# EAGLE design audio_controller_x2 (EAGLE 9.5.2)
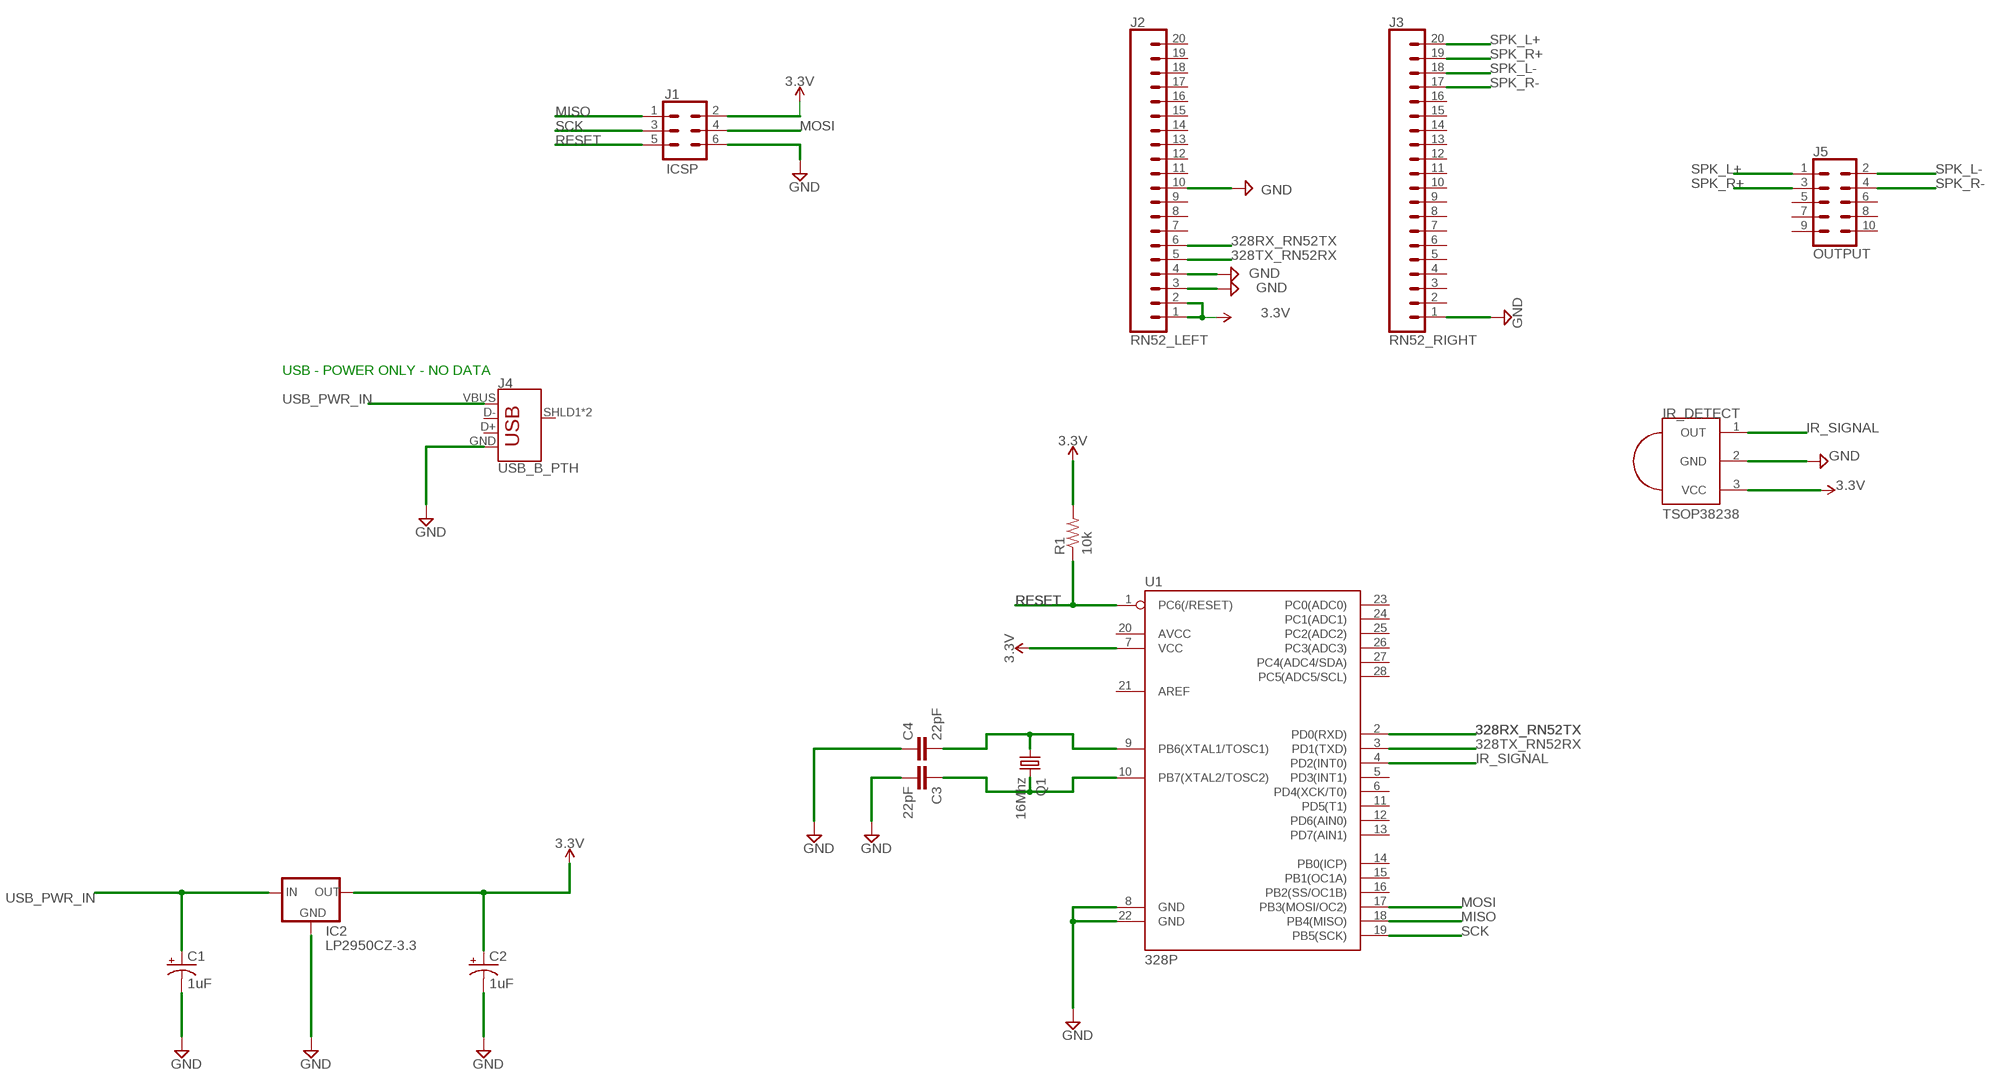
[diagram p0: schematic, sheet 1]

## Parts
C1  1uF  CPOL-USE2.5-5  [E2,5-5]
C2  1uF  CPOL-USE2.5-5  [E2,5-5]
C3  22pF  22PF-PTH-2.54MM-200V-5%  [CAP-PTH-2.54]
C4  22pF  22PF-PTH-2.54MM-200V-5%  [CAP-PTH-2.54]
IC2  LP2950CZ-3.3  [TO92]
IR_DETECT  TSOP38238  PNA460XM  [PNA460XM]
J1  ICSP  CONN_03X2SHROUD  [2X3-SHROUDED]
J2  RN52_LEFT  CONN_20  [1X20]
J3  RN52_RIGHT  CONN_20  [1X20]
J4  USB_B_PTH  [USB-B-PTH]
J5  OUTPUT  CONN_05X2SHD  [2X5-SHROUDED]
Q1  16Mhz  CRYSTALHC49S  [HC49/S]
R1  10k  R-US_0207/10  [0207/10]
U1  328P  ATMEGA328P_PDIP  [DIP28]

## Nets
3.3V: C2.+ IC2.1(OUT) IR_DETECT.3(VCC) J1.2 J2.1 J2.2 R1.2 U1.7(VCC)
328RX_RN52TX: J2.6 U1.2(PD0(RXD))
328TX_RN52RX: J2.5 U1.3(PD1(TXD))
GND: C1.- C2.- C3.2 C4.1 IC2.2(GND) IR_DETECT.2(GND) J1.6 J2.3 J2.4 J2.10 J3.1 J4.GND U1.8(GND) U1.22(GND)
IR_SIGNAL: IR_DETECT.1(OUT) U1.4(PD2(INT0))
MISO: J1.1 U1.18(PB4(MISO))
MOSI: J1.4 U1.17(PB3(MOSI/OC2))
N$2: C4.2 Q1.1 U1.9(PB6(XTAL1/TOSC1))
N$3: C3.1 Q1.2 U1.10(PB7(XTAL2/TOSC2))
RESET: J1.5 R1.1 U1.1(PC6(/RESET))
SCK: J1.3 U1.19(PB5(SCK))
SPK_L+: J3.20 J5.1
SPK_L-: J3.18 J5.2
SPK_R+: J3.19 J5.3
SPK_R-: J3.17 J5.4
USB_PWR_IN: C1.+ IC2.3(IN) J4.VBUS
Unconnected: J2.7 J2.8 J2.9 J2.11 J2.12 J2.13 J2.14 J2.15 J2.16 J2.17 J2.18 J2.19 J2.20 J3.2 J3.3 J3.4 J3.5 J3.6 J3.7 J3.8 J3.9 J3.10 J3.11 J3.12 J3.13 J3.14 J3.15 J3.16 J4.D+ J4.D- J4.SHLD1(SHIELD) J4.SHLD2(SHIELD) J5.5 J5.6 J5.7 J5.8 J5.9 J5.10 U1.5(PD3(INT1)) U1.6(PD4(XCK/T0)) U1.11(PD5(T1)) U1.12(PD6(AIN0)) U1.13(PD7(AIN1)) U1.14(PB0(ICP)) U1.15(PB1(OC1A)) U1.16(PB2(SS/OC1B)) U1.20(AVCC) U1.21(AREF) U1.23(PC0(ADC0)) U1.24(PC1(ADC1)) U1.25(PC2(ADC2)) U1.26(PC3(ADC3)) U1.27(PC4(ADC4/SDA)) U1.28(PC5(ADC5/SCL))

## Notes on the sheet
- USB - POWER ONLY - NO DATA

## Library data of the parts
C1 C2 = adafruit:CPOL-US: POLARIZED CAPACITOR, American symbol
C3 C4 = SparkFun-Capacitors:22PF: 22pF ceramic capacitors A capacitor is a passive two-terminal electrical component used to store electrical energy temporarily in an electric field.; PROD_ID: CAP-09128
IC2 = v-reg:LP2950?*: Source: http://cache.national.com/ds/LP/LP2950.pdf
IR_DETECT = adafruit:PNA460XM: IR 38KHz receiver PNA4602 and related receivers http://www.ladyada.net/library/pcb/eaglelibrary.html; SPICEPREFIX: J
J1 = SparkFun-Connectors:CONN_03X2: Multi connection point. Often used as Generic Header-pin footprint for 0.1 inch spaced/style header connections You can populate with any combo of single row headers, but if you'd like an exact match, check these: Header - 2x3 (Male, 0.1") <https://www.sparkfun.com/products/12807> (PRT-12807) Header - 2x3 (Female, 0.1") <https://www.sparkfun.com/products/13010> (PRT-13010) 2x3 Pin Shrouded Header <https://www.sparkfun.com/products/10877> (PRT-10877) On any of the 0.1 inch spaced packages, you can populate with these: Break Away Headers - Straight <https://www.sparkfun.com/products/116> (PRT-00116) Break Away Male Headers - Right Angle <https://www.sparkfun.com/products/553> (PRT-00553) Female Headers <https://www.sparkfun.com/products/115> (PRT-00115) Break Away Headers - Machine Pin <https://www.sparkfun.com/products/117> (PRT-00117) Break Away Female Headers - Swiss Machine Pin <https://www.sparkfun.com/products/743> (PRT-00743) Special note: the shrouded connector mates well with our 3x2 ribbon cables: Ribbon Crimp Connector - 6-pin (2x3, Female) <https://www.sparkfun.com/products/10651> (PRT-10651) Ribbon Cable - 6 wire (15ft) <https://www.sparkfun.com/products/10646> (PRT-10646); PROD_ID: CONN-10681; SF_ID: PRT_10877
J2 J3 = SparkFun-Connectors:CONN_20: Multi connection point. Often used as Generic Header-pin footprint for 0.1 inch spaced/style header connections On any of the 0.1 inch spaced packages, you can populate with these: Break Away Headers - Straight <https://www.sparkfun.com/products/116> (PRT-00116) Break Away Male Headers - Right Angle <https://www.sparkfun.com/products/553> (PRT-00553) Female Headers <https://www.sparkfun.com/products/115> (PRT-00115) Break Away Headers - Machine Pin <https://www.sparkfun.com/products/117> (PRT-00117) Break Away Female Headers - Swiss Machine Pin <https://www.sparkfun.com/products/743> (PRT-00743) For SCREWTERMINALS and SPRING TERMINALS visit here: Screw Terimnals on SparkFun.com <https://www.sparkfun.com/search/results?term=Screw+Terminals> (5mm/3.5mm/2.54mm spacing) This device is also useful as a general connection point to wire up your design to another part of your project. Our various solder wires solder well into these plated through hole pads. Hook-Up Wire - Assortment (Stranded, 22 AWG) <https://www.sparkfun.com/products/11375> (PRT-11375) Hook-Up Wire - Assortment (Solid Core, 22 AWG) <https://www.sparkfun.com/products/11367> (PRT-11367) View the entire wire category on our website here <https://www.sparkfun.com/categories/141> Special notes: Molex polarized connector foot print use with SKU : PRT-08231 with associated crimp pins and housings. 1MM SMD Version SKU: PRT-10208 NOTES ON THE VARIANTS LOCK and LOCK_LONGPADS... This footprint was designed to help hold the alignment of a through-hole component (i.e. 6-pin header) while soldering it into place. You may notice that each hole has been shifted either up or down by 0.005 of an inch from it's more standard position (which is a perfectly straight line). This slight alteration caused the pins (the squares in the middle) to touch the edges of the holes. Because they are alternating, it causes a "brace" to hold the component in place. 0.005 has proven to be the perfect amount of "off-center" position when using our standard breakaway headers. Although looks a little odd when you look at the bare footprint, once you have a header in there, the alteration is very hard to notice. Also,if you push a header all the way into place, it is covered up entirely on the bottom side. Note about LOCK SPECIAL package: This is just like the LOCK variant in that the holes are staggared by 5 mil, but except for the last two holes. They are not altered from the "standard" footprint layout. This is used for a special purpose on the layout of our Graphic LCD Backpack. Make sure you want to use this device before selecting it for you project!
J4 = SparkFun-Connectors:USB_B: USB Type B Connector SparkFun Products: SparkFun Stepoko <https://www.sparkfun.com/products/13899> PTH; PROD_ID: CONN-08278; SF_ID: PRT-00139
J5 = SparkFun-Connectors:CONN_05X2: Multi connection point. Often used as Generic Header-pin footprint for 0.1 inch spaced/style header connections For AVR SPI programming port, see special device with nice symbol: "AVR_SPI_PROG_5x2.dev" You can populate with any combo of single row headers, but if you'd like an exact match, check these: 2x5 AVR ICSP Male Header <https://www.sparkfun.com/products/778> (PRT-00778) 2x5 Pin Shrouded Header <https://www.sparkfun.com/products/8506> (PRT-08506) On any of the 0.1 inch spaced packages, you can populate with these: Break Away Headers - Straight <https://www.sparkfun.com/products/116> (PRT-00116) Break Away Male Headers - Right Angle <https://www.sparkfun.com/products/553> (PRT-00553) Female Headers <https://www.sparkfun.com/products/115> (PRT-00115) Break Away Headers - Machine Pin <https://www.sparkfun.com/products/117> (PRT-00117) Break Away Female Headers - Swiss Machine Pin <https://www.sparkfun.com/products/743> (PRT-00743) Special note: the shrouded connector mates well with our 5x2 ribbon cables: 2x5 Pin IDC Ribbon Cable <https://www.sparkfun.com/products/8535> (PRT-08535); PROD_ID: CONN-08671; SF_ID: PRT-08506
Q1 = crystal:CRYSTAL: CRYSTAL; OC_FARNELL: 1667008; OC_NEWARK: unknown
R1 = adafruit:R-US_: RESISTOR, American symbol
U1 = SparkFun-IC-Microcontroller:ATMEGA328P_PDIP: Atmel 328P Through hole ATMEGA328P uC used in the Arduino 32kb flash, 1k EEPROM, 2k SRAM Datasheet <http://www.sparkfun.com/datasheets/Components/SMD/ATMega328.pdf> SparkFun Products Storefront component: AVR 28 Pin 20MHz 32K 6A/D - ATMega328P <https://www.sparkfun.com/products/9061> (COM-09061) SparkFun Simon Says - Through-Hole Soldering Kit <https://www.sparkfun.com/products/10547> (KIT-10547) SparkFun Learn to Solder - Simon Says <https://www.sparkfun.com/products/13708> (KIT-13708) SparkFun BigTime Watch Kit <https://www.sparkfun.com/products/11734> (KIT-11734) SparkFun ClockIt <https://www.sparkfun.com/products/10930> (KIT-10930) SparkFun Serial Enabled LCD Kit <https://www.sparkfun.com/products/10097> (LCD-10097) SparkFun Simon Tilts - Through Hole Soldering Kit <https://www.sparkfun.com/products/12634> (KIT-12634) SparkFun Frequency Counter Kit <https://www.sparkfun.com/products/10140> (KIT-10140) FabFM Radio Kit <https://www.sparkfun.com/products/11043> (KIT-11043) SparkFun Binary Blaster Kit <https://www.sparkfun.com/products/12037> (KIT-12037) SparkFun Metro-Gnome <https://www.sparkfun.com/products/9236> (KIT-09236) ATmega328 with Arduino Optiboot (Uno) <https://www.sparkfun.com/products/10524> (DEV-10524); PROD_ID: IC-09136

## Board
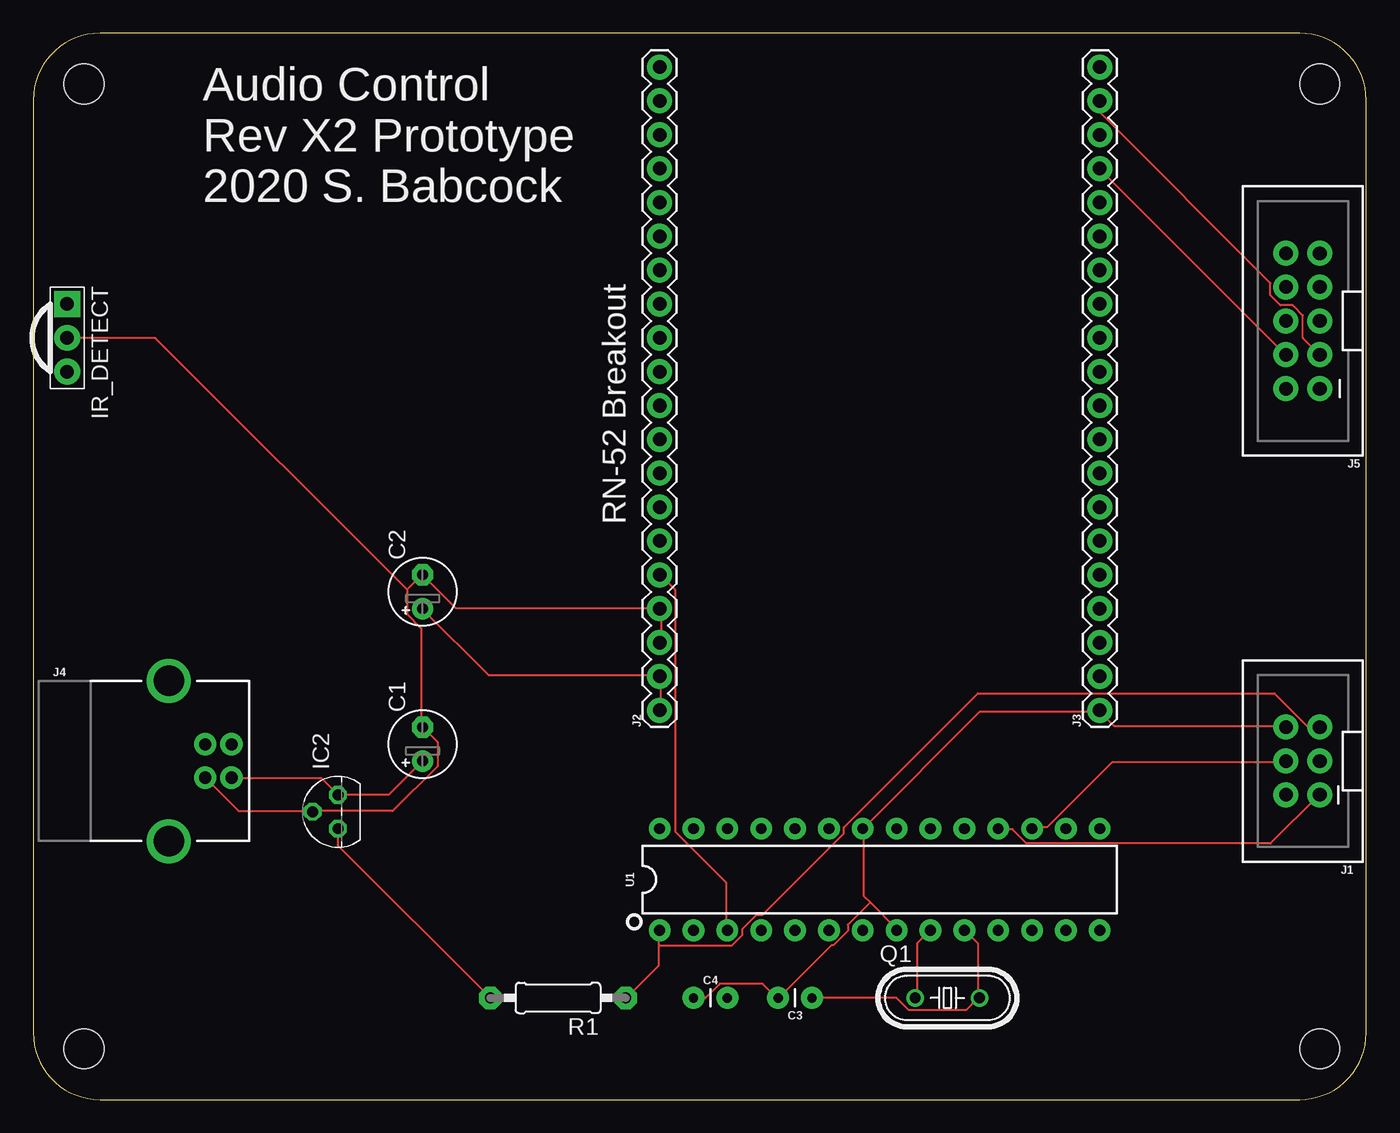
[diagram p1: board, top side]
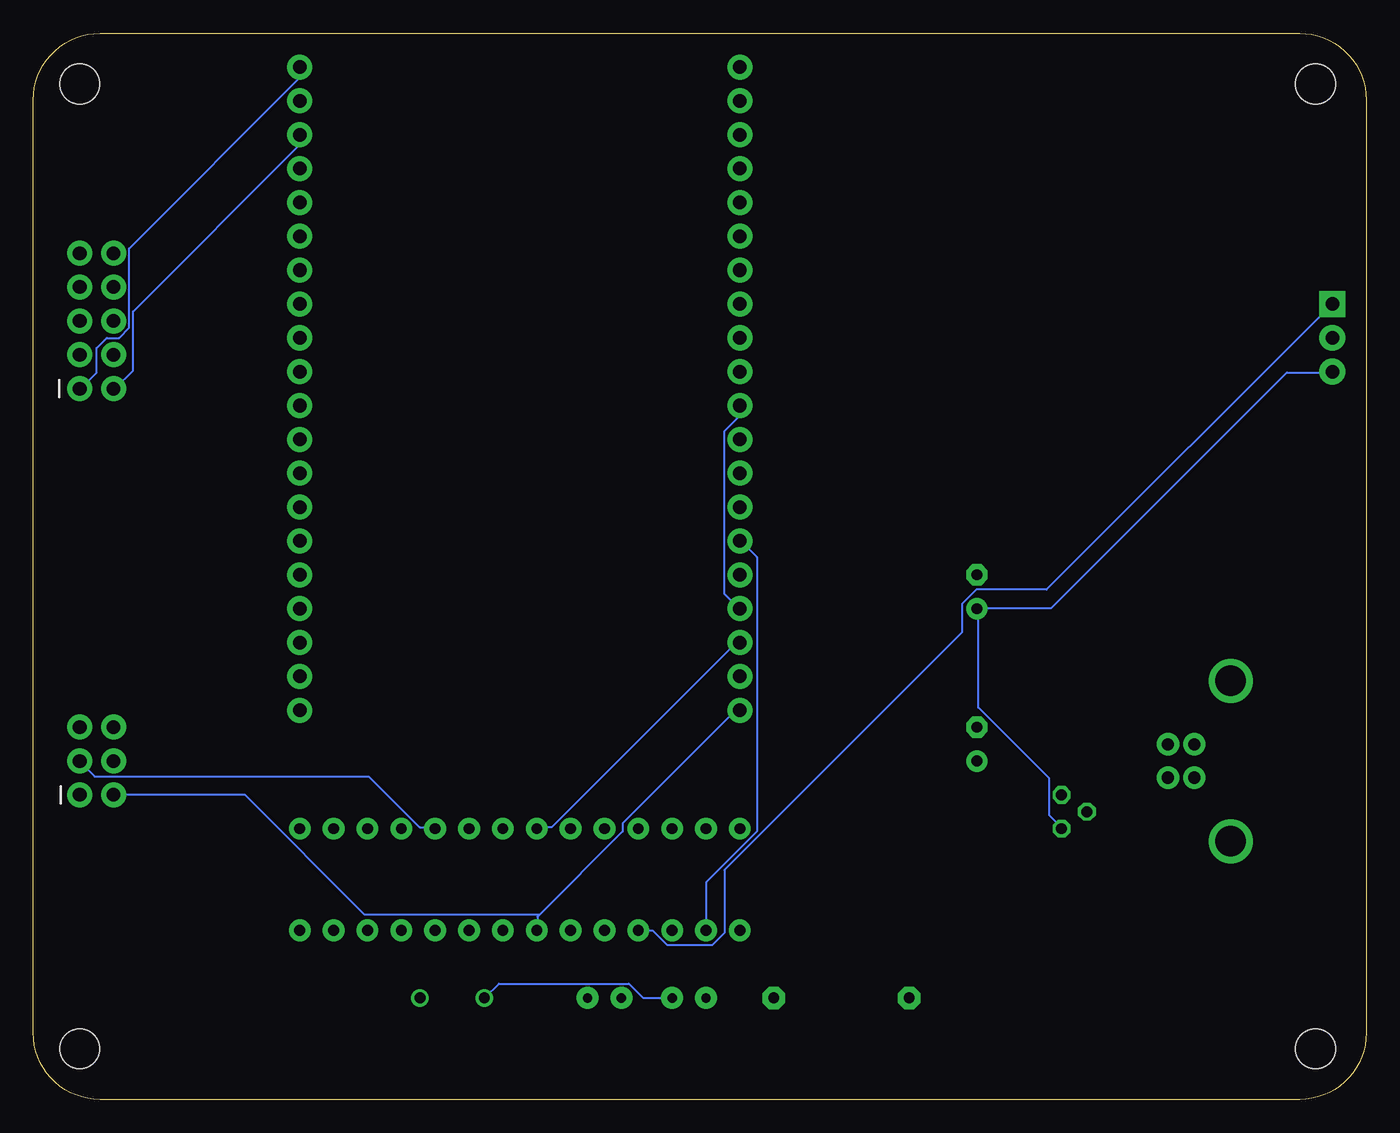
[diagram p2: board, bottom side, seen from below]

Size 100 x 80 mm. Coordinates in mm from the lower left corner, seen from the top.
Outline: 0,75 0,5 arc90 5,0 95,0 arc90 100,5 100,75 arc90 95,80 5,80 arc90 0,75
Copper layers (1*16): Top 0.035mm / dielectric 1.5mm / Bottom 0.035mm
Design rules "default": minimum track width 6mil, minimum drill 0.35mm, track to track 6mil, track to pad 6mil, pad to pad 6mil, via to via 6mil, smd to smd 6mil, copper to edge 40mil, drill to drill 6mil, minimum pad ring 10mil, minimum via ring 8mil, stop-mask expansion 4mil, vias tented up to drill 0mil, thermal gap 10mil
Holes 3 mm at 3.81,3.81 96.52,3.81 3.81,76.2 96.52,76.2

### Footprints (pad centres in the part's own frame; a part is rotated, then mirrored left to right if it is on the bottom)
E2,5-5 = drill 0.813 pad 1.6: + -1.27,0 | drill 0.813 pad 1.6 octagon: - 1.27,0
CAP-PTH-2.54 = drill 0.7 pad 1.651: 1 -1.27,0; 2 1.27,0
TO92 = drill 0.813 octagon: 1 -1.27,0; 2 0,1.905; 3 1.27,0
PNA460XM = drill 1.016 pad 1.93 square: 1 -2.54,0 | drill 1.016 pad 1.93: 2 0,0; 3 2.54,0
2X3-SHROUDED = drill 1.016 pad 1.88: 1 -1.27,2.54; 2 1.27,2.54; 3 -1.27,0; 4 1.27,0; 5 -1.27,-2.54; 6 1.27,-2.54
1X20 = drill 1.016 pad 1.88: 1 0,0; 2 2.54,0; 3 5.08,0; 4 7.62,0; 5 10.16,0; 6 12.7,0; 7 15.24,0; 8 17.78,0; 9 20.32,0; 10 22.86,0; 11 25.4,0; 12 27.94,0; 13 30.48,0; 14 33.02,0; 15 35.56,0; 16 38.1,0; 17 40.64,0; 18 43.18,0; 19 45.72,0; 20 48.26,0
USB-B-PTH = drill 0.914 pad 1.676: D+ 4,1.25; D- 5.981,1.25; GND 4,-1.25; VBUS 5.981,-1.25 | drill 2.286: SHLD1 1.282,-6.02; SHLD2 1.282,6.02
2X5-SHROUDED = drill 1.016 pad 1.88: 1 -1.27,5.08; 2 1.27,5.08; 3 -1.27,2.54; 4 1.27,2.54; 5 -1.27,0; 6 1.27,0; 7 -1.27,-2.54; 8 1.27,-2.54; 9 -1.27,-5.08; 10 1.27,-5.08
HC49/S = drill 0.813: 1 -2.413,0; 2 2.413,0
0207/10 = drill 0.813 pad 1.676 octagon: 1 -5.08,0; 2 5.08,0
DIP28 = drill 0.813 pad 1.626: 1 -16.51,-3.81; 2 -13.97,-3.81; 3 -11.43,-3.81; 4 -8.89,-3.81; 5 -6.35,-3.81; 6 -3.81,-3.81; 7 -1.27,-3.81; 8 1.27,-3.81; 9 3.81,-3.81; 10 6.35,-3.81; 11 8.89,-3.81; 12 11.43,-3.81; 13 13.97,-3.81; 14 16.51,-3.81; 15 16.51,3.81; 16 13.97,3.81; 17 11.43,3.81; 18 8.89,3.81; 19 6.35,3.81; 20 3.81,3.81; 21 1.27,3.81; 22 -1.27,3.81; 23 -3.81,3.81; 24 -6.35,3.81; 25 -8.89,3.81; 26 -11.43,3.81; 27 -13.97,3.81; 28 -16.51,3.81

### Placement (x,y rotation side)
C1  29.21,26.67 90 top
C2  29.21,38.1 90 top
C3  57.15,7.62 180 top
C4  50.8,7.62 0 top
IC2  22.86,21.59 90 top
IR_DETECT  2.54,57.15 270 top
J1  95.25,25.4 180 top
J2  46.99,29.21 90 top
J3  80.01,29.21 90 top
J4  8.89,25.4 0 top
J5  95.25,58.42 180 top
Q1  68.58,7.62 0 top
R1  39.37,7.62 180 top
U1  63.5,16.51 0 top

### Tracks (layer width: path | path; a pad name or v marks a point on that pad's centre or on a via)
3.3V
  Top 0.152: J2.1 47.09,29.26 47.09,31.7 J2.2 46.94,31.85 34.14,31.85 29.26,36.73 C2.+ | IC2.1 22.86,19.05 R1.2
  Bottom 0.152: 62.03,13.87 55.78,20.12 55.78,20.73 47.4,29.11 47.09,29.11 J2.1 | 62.03,13.87 62.18,13.72 62.18,12.8 U1.7 | J1.2 84.12,22.86 75.13,13.87 62.03,13.87 | IC2.1 22.86,20.42 23.77,21.34 23.77,24.08 29.11,29.41 29.11,36.73 C2.+ 29.11,36.88 23.62,36.88 5.94,54.56 2.64,54.56 IR_DETECT.3
328RX_RN52TX
  Bottom 0.152: U1.2 49.53,16.31 45.72,20.12 45.72,40.69 46.94,41.91 J2.6
328TX_RN52RX
  Top 0.152: U1.3 51.97,12.8 51.97,16.31 48.16,20.12 48.16,38.25 47.09,39.32 J2.5
GND
  Top 0.152: 80.01,29.11 81.08,28.04 93.88,28.04 J1.6 | C4.1 50.44,7.62 51.51,8.69 54.71,8.69 55.78,7.62 C3.2 55.93,7.62 59.89,11.58 60.05,11.58 61.11,12.65 61.11,13.11 62.79,14.78 | 62.79,14.78 64.77,12.8 U1.8 | 62.79,14.78 62.33,15.24 62.33,20.27 U1.22 71.02,29.11 80.01,29.11 | 80.01,29.11 J3.1 | J2.3 47.09,34.29 47.09,36.73 J2.4 46.94,36.88 31.7,36.88 C2.- 29.11,39.32 28.04,38.25 | J4.GND 12.95,24.08 15.39,21.64 20.88,21.64 IC2.2 21.03,21.64 26.98,21.64 30.33,24.99 30.33,26.82 C1.- 29.11,28.04 29.11,35.36 28.04,36.42 28.04,38.25 | IR_DETECT.2 9.14,57.15 28.04,38.25
  Bottom 0.152: J2.10 47.09,51.97 47.09,51.21 48.16,50.14 48.16,37.95 47.09,36.88 J2.4 | J2.3 47.24,34.29 61.11,20.42 62.18,20.42 U1.22
IR_SIGNAL
  Bottom 0.152: IR_DETECT.1 23.98,38.25 29.26,38.25 30.33,37.19 30.33,35.05 48.16,17.22 48.16,12.5 49.07,11.58 52.43,11.58 53.49,12.65 54.56,12.65 U1.4
MISO
  Top 0.152: U1.18 72.39,20.27 73.46,20.27 74.52,19.2 92.81,19.2 96.47,22.86 J1.1
MOSI
  Top 0.152: U1.17 74.98,20.42 76.05,20.42 80.92,25.3 93.88,25.3 J1.4
N$2
  Top 0.152: Q1.1 66.29,7.62 66.29,11.73 67.21,12.65 U1.9
  Bottom 0.152: C4.2 54.25,7.62 55.32,8.69 65.08,8.69 66.14,7.62 Q1.1
N$3
  Top 0.152: 70.87,7.62 70.87,11.73 69.95,12.65 U1.10 | C3.1 64.77,7.62 65.68,6.71 69.95,6.71 70.87,7.62 | 70.87,7.62 Q1.2
RESET
  Top 0.152: 46.94,11.58 46.94,10.06 44.5,7.62 R1.1 | 46.94,11.58 46.94,12.65 U1.1 | 46.94,11.58 52.43,11.58 53.19,12.34 53.19,12.8 54.25,13.87 54.71,13.87 60.81,19.96 60.81,20.42 70.87,30.48 93.12,30.48 95.56,28.04 96.47,28.04 J1.5
SCK
  Bottom 0.152: U1.19 69.95,20.42 71.02,20.42 74.83,24.23 95.4,24.23 96.47,25.3 J1.3
SPK_L+
  Bottom 0.152: J3.20 80.01,76.66 92.81,63.86 92.81,57.91 93.57,57.15 94.49,57.15 95.25,56.39 95.25,54.56 96.47,53.34 J5.1
SPK_L-
  Bottom 0.152: J3.18 80.01,71.63 92.51,59.13 92.51,54.71 93.88,53.34 J5.2
SPK_R+
  Top 0.152: J3.19 80.01,74.07 92.81,61.27 92.81,60.35 93.57,59.59 94.49,59.59 95.25,58.83 95.25,57.15 J5.3
SPK_R-
  Top 0.152: J5.4 93.88,55.93 80.01,69.8 J3.17
USB_PWR_IN
  Top 0.152: C1.+ 26.67,22.86 IC2.3 21.64,24.08 14.94,24.08 J4.VBUS

### Text on the board
tNames: Audio Control / Rev X2 Prototype / 2020 S. Babcock | RN-52 Breakout